# Altium project Terra.PrjPcb (part 1 of 3)
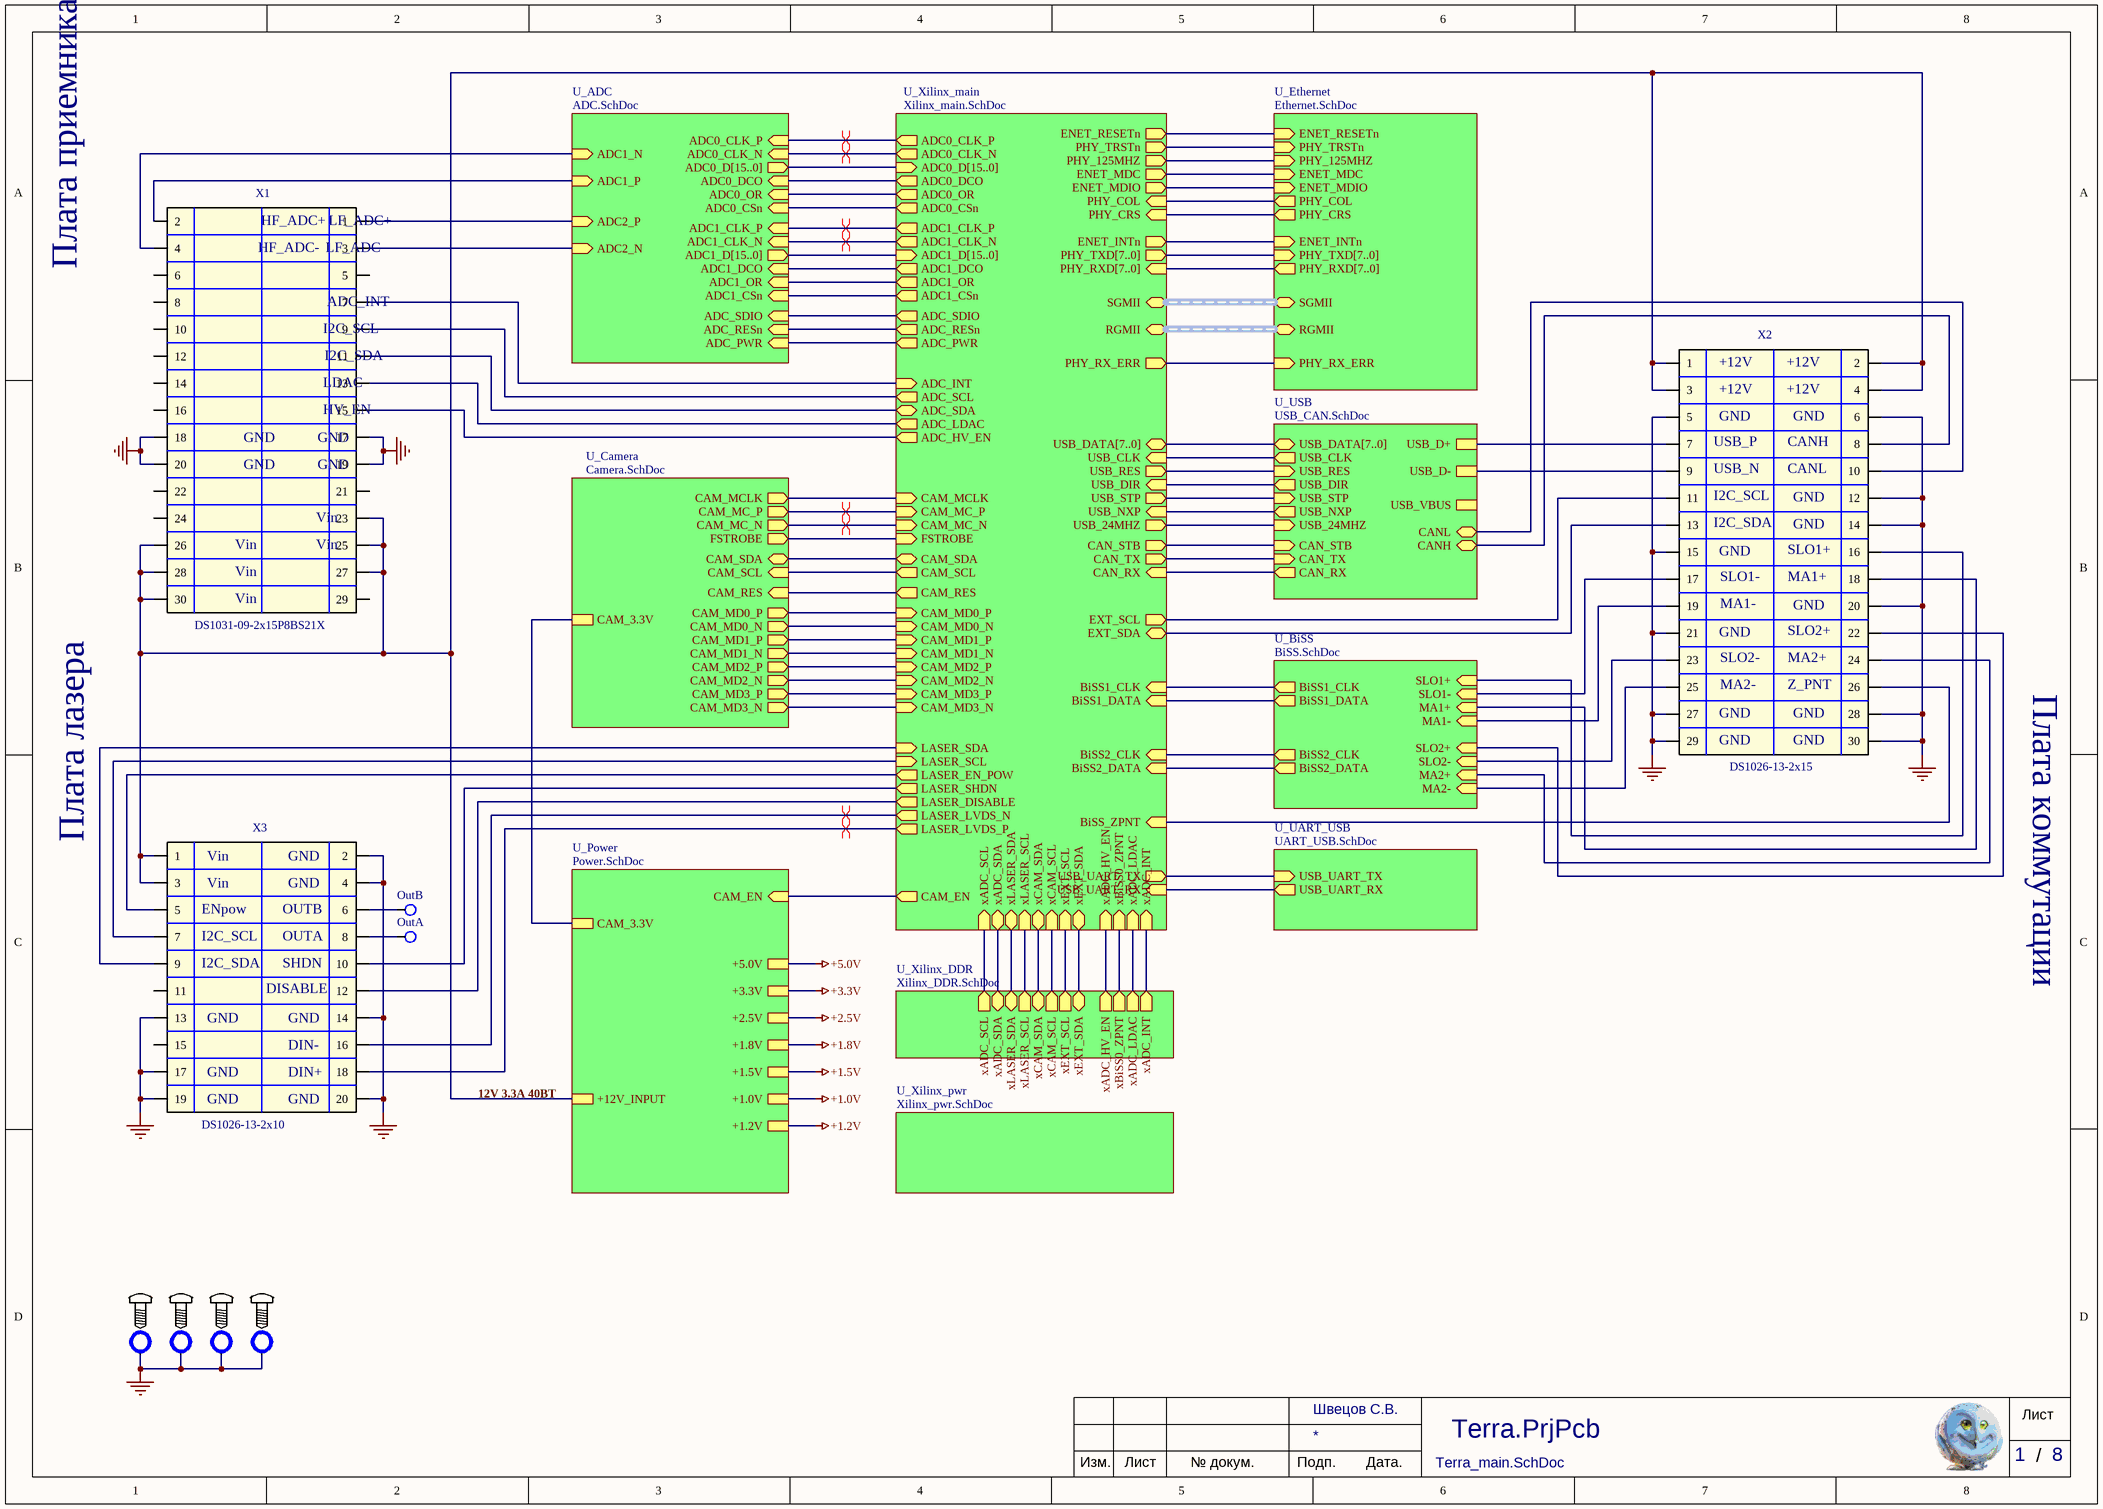
[diagram p0: Terra_main.SchDoc]
11 sheets, 559 parts. Net scope: hierarchical (ports join the sheet entries above them; power ports are global).
Board file: Terra.PcbDoc
Sheets:
  Terra_main.SchDoc
    U_Xilinx_main = Xilinx_main.SchDoc
    U_USB = USB_CAN.SchDoc
    U_BiSS = BiSS.SchDoc
    U_UART_USB = UART_USB.SchDoc
    U_Xilinx_DDR = Xilinx_DDR.SchDoc
    U_Xilinx_pwr = Xilinx_pwr.SchDoc
    U_ADC = ADC.SchDoc
    U_Power = Power.SchDoc
    U_Ethernet = Ethernet.SchDoc
    U_Camera = Camera.SchDoc

## Sheet Terra_main.SchDoc
size A3; Author: Швецов С.В.; Organization: PapuaSoft; SheetNumber: 1; SheetTotal: 8

### Parts
DRL1  Drill  [Drill 3.2]  (value not drawn)  (no BOM)
DRL2  Drill  [Drill 3.2]  (value not drawn)  (no BOM)
DRL3  Drill  [Drill 3.2]  (value not drawn)  (no BOM)
DRL4  Drill  [Drill 3.2]  (value not drawn)  (no BOM)
TP5  MarkPCB: OutB  [TP_0MM5_1MM0]  (no BOM)
TP6  MarkPCB: OutA  [TP_0MM5_1MM0]  (no BOM)
X1  DS1031-09-2x15P8BS21X  [DS1031-09-2x15]
X2  DS1026-13-2x15  [DS1026-13-2x15]
X3  value DS1026-13-2x10  [DS1026-13-2x10]  (hidden comment: DS1031-09-2x10P8BS21X)

### Sub-sheets
U_ADC = ADC.SchDoc: ADC0_CLK_N (in), ADC0_CLK_P (in), ADC1_CLK_N (in), ADC1_CLK_P (in), ADC0_D[15..0] (out), ADC1_D[15..0] (out), ADC1_P (in), ADC1_N (in), ADC2_P (in), ADC2_N (in), ADC_RESn (in), ADC0_CSn (in), ADC_SDIO (in), ADC_PWR (in), ADC1_CSn (in), ADC0_OR (in), ADC0_DCO (in), ADC1_OR (in), ADC1_DCO (in)
U_BiSS = BiSS.SchDoc: BiSS1_CLK (out), BiSS1_DATA (out), BiSS2_CLK (out), BiSS2_DATA (out), SLO1+ (in), SLO1- (in), MA1- (in), MA1+ (in), SLO2+ (in), SLO2- (in), MA2- (in), MA2+ (in)
U_Camera = Camera.SchDoc: CAM_SCL (in), CAM_SDA (bidir), CAM_MCLK (out), CAM_RES (in), CAM_3.3V, CAM_MC_P (out), CAM_MC_N (out), FSTROBE (out), CAM_MD3_N (out), CAM_MD3_P (out), CAM_MD2_N (out), CAM_MD2_P (out), CAM_MD1_N (out), CAM_MD1_P (out), CAM_MD0_N (out), CAM_MD0_P (out)
U_Ethernet = Ethernet.SchDoc: ENET_RESETn (in), PHY_TRSTn (in), PHY_125MHZ (in), ENET_MDC (in), ENET_MDIO (in), PHY_COL (out), PHY_CRS (out), SGMII (bidir), ENET_INTn (in), PHY_TXD[7..0] (in), PHY_RXD[7..0] (out), RGMII (bidir), PHY_RX_ERR (in)
U_Power = Power.SchDoc: +1.0V, +1.8V, +1.5V, +12V_INPUT, CAM_EN (in), CAM_3.3V, +3.3V, +5.0V, +2.5V, +1.2V
U_UART_USB = UART_USB.SchDoc: USB_UART_TX (in), USB_UART_RX (out)
U_USB = USB_CAN.SchDoc: USB_DATA[7..0] (bidir), USB_CLK (out), USB_NXP (out), USB_DIR (out), USB_STP (in), USB_RES (in), CAN_TX (in), CAN_RX (out), CAN_STB (in), CANH (bidir), CANL (bidir), USB_VBUS, USB_D-, USB_D+, USB_24MHZ (in)
U_Xilinx_DDR = Xilinx_DDR.SchDoc: xADC_SCL (out), xADC_SDA (bidir), xLASER_SDA (bidir), xLASER_SCL (out), xCAM_SDA (bidir), xCAM_SCL (out), xEXT_SCL (out), xEXT_SDA (bidir), xADC_HV_EN (out), xBiSS0_ZPNT (out), xADC_LDAC (out), xADC_INT (out)
U_Xilinx_main = Xilinx_main.SchDoc: ADC_SDA (bidir), ADC_SCL (out), CAM_EN (out), USB_CLK (in), USB_DIR (in), USB_RES (out), USB_DATA[7..0] (bidir), USB_STP (out), USB_NXP (in), BiSS1_CLK (in), BiSS1_DATA (in), BiSS_ZPNT (in), BiSS2_CLK (in), BiSS2_DATA (in), LASER_SHDN (out), LASER_DISABLE (out), LASER_EN_POW (out), LASER_LVDS_N (out), LASER_SDA (in), LASER_SCL (in), LASER_LVDS_P (out), USB_UART_RX (in), USB_UART_TX (out), CAN_STB (out), CAN_RX (in), CAN_TX (out), ADC_INT (in), ADC_LDAC (out), ADC_HV_EN (out), USB_24MHZ (out), ADC0_CLK_P (out), ADC0_CLK_N (out), ADC0_DCO (out), ADC0_OR (out), ADC0_CSn (out), ADC1_CLK_P (out), ADC1_CLK_N (out), ADC1_DCO (out), ADC1_OR (out), ADC1_CSn (out), ADC_SDIO (out), ADC_RESn (out), ADC_PWR (out), ADC0_D[15..0] (in), ADC1_D[15..0] (in), ENET_RESETn (out), PHY_TRSTn (out), PHY_125MHZ (out), ENET_MDC (out), ENET_MDIO (out), PHY_COL (in), PHY_CRS (in), ENET_INTn (out), PHY_RX_ERR (out), PHY_TXD[7..0] (out), PHY_RXD[7..0] (in), EXT_SDA (bidir), EXT_SCL (out), CAM_MCLK (in), CAM_MC_P (in), CAM_MC_N (in), FSTROBE (in), CAM_SDA (bidir), CAM_SCL (out), CAM_RES (out), CAM_MD3_N (in), CAM_MD3_P (in), CAM_MD2_N (in), CAM_MD2_P (in), CAM_MD1_N (in), CAM_MD1_P (in), CAM_MD0_N (in), CAM_MD0_P (in), xLASER_SDA (bidir), xLASER_SCL (in), xCAM_SDA (bidir), xCAM_SCL (in), xEXT_SDA (bidir), xEXT_SCL (in), xADC_SDA (bidir), xADC_SCL (in), xADC_HV_EN (in), xBiSS0_ZPNT (in), xADC_LDAC (in), xADC_INT (in), SGMII (bidir), RGMII (bidir)
U_Xilinx_pwr = Xilinx_pwr.SchDoc: no entries

### Nets
GND: DRL1.1 DRL2.1 DRL3.1 DRL4.1 X1.17 X1.18 X1.19 X1.20 X1.23 X1.25 X1.26 X1.27 X1.28 X1.30 X2.1 X2.2 X2.3 X2.4 X2.5 X2.6 X2.12 X2.14 X2.15 X2.20 X2.21 X2.27 X2.28 X2.29 X2.30 X3.1 X3.2 X3.3 X3.4 X3.13 X3.14 X3.17 X3.19 X3.20 ; sheet U_Power/+12V_INPUT  [project net +12V_INPUT]
ADC0_CLK_N: sheet U_Xilinx_main/ADC0_CLK_N, sheet U_ADC/ADC0_CLK_N
ADC0_CLK_P: sheet U_Xilinx_main/ADC0_CLK_P, sheet U_ADC/ADC0_CLK_P
ADC0_CSn: sheet U_Xilinx_main/ADC0_CSn, sheet U_ADC/ADC0_CSn
ADC0_DCO: sheet U_Xilinx_main/ADC0_DCO, sheet U_ADC/ADC0_DCO
ADC0_OR: sheet U_Xilinx_main/ADC0_OR, sheet U_ADC/ADC0_OR
ADC1_CLK_N: sheet U_Xilinx_main/ADC1_CLK_N, sheet U_ADC/ADC1_CLK_N
ADC1_CLK_P: sheet U_Xilinx_main/ADC1_CLK_P, sheet U_ADC/ADC1_CLK_P
ADC1_CSn: sheet U_Xilinx_main/ADC1_CSn, sheet U_ADC/ADC1_CSn
ADC1_DCO: sheet U_Xilinx_main/ADC1_DCO, sheet U_ADC/ADC1_DCO
ADC1_OR: sheet U_Xilinx_main/ADC1_OR, sheet U_ADC/ADC1_OR
ADC_HV_EN: X1.15 ; sheet U_Xilinx_main/ADC_HV_EN
ADC_INT: X1.7 ; sheet U_Xilinx_main/ADC_INT
ADC_LDAC: X1.13 ; sheet U_Xilinx_main/ADC_LDAC
ADC_PWR: sheet U_Xilinx_main/ADC_PWR, sheet U_ADC/ADC_PWR
ADC_RESn: sheet U_Xilinx_main/ADC_RESn, sheet U_ADC/ADC_RESn
ADC_SDIO: sheet U_Xilinx_main/ADC_SDIO, sheet U_ADC/ADC_SDIO
BiSS0_ZPNT: X2.26 ; sheet U_Xilinx_main/BiSS_ZPNT
CAM_EN: sheet U_Xilinx_main/CAM_EN, sheet U_Power/CAM_EN
CAM_MC_N: sheet U_Xilinx_main/CAM_MC_N, sheet U_Camera/CAM_MC_N
CAM_MC_P: sheet U_Xilinx_main/CAM_MC_P, sheet U_Camera/CAM_MC_P
CAM_MCLK: sheet U_Xilinx_main/CAM_MCLK, sheet U_Camera/CAM_MCLK
CAM_MD0_N: sheet U_Xilinx_main/CAM_MD0_N, sheet U_Camera/CAM_MD0_N
CAM_MD0_P: sheet U_Xilinx_main/CAM_MD0_P, sheet U_Camera/CAM_MD0_P
CAM_MD1_N: sheet U_Xilinx_main/CAM_MD1_N, sheet U_Camera/CAM_MD1_N
CAM_MD1_P: sheet U_Xilinx_main/CAM_MD1_P, sheet U_Camera/CAM_MD1_P
CAM_MD2_N: sheet U_Xilinx_main/CAM_MD2_N, sheet U_Camera/CAM_MD2_N
CAM_MD2_P: sheet U_Xilinx_main/CAM_MD2_P, sheet U_Camera/CAM_MD2_P
CAM_MD3_N: sheet U_Xilinx_main/CAM_MD3_N, sheet U_Camera/CAM_MD3_N
CAM_MD3_P: sheet U_Xilinx_main/CAM_MD3_P, sheet U_Camera/CAM_MD3_P
CAM_RES: sheet U_Xilinx_main/CAM_RES, sheet U_Camera/CAM_RES
ENET_INTn: sheet U_Xilinx_main/ENET_INTn, sheet U_Ethernet/ENET_INTn
ENET_MDC: sheet U_Xilinx_main/ENET_MDC, sheet U_Ethernet/ENET_MDC
ENET_MDIO: sheet U_Xilinx_main/ENET_MDIO, sheet U_Ethernet/ENET_MDIO
ENET_RESETn: sheet U_Xilinx_main/ENET_RESETn, sheet U_Ethernet/ENET_RESETn
FSTROBE: sheet U_Xilinx_main/FSTROBE, sheet U_Camera/FSTROBE
LASER_LVDS_N: X3.16 ; sheet U_Xilinx_main/LASER_LVDS_N
LASER_LVDS_P: X3.18 ; sheet U_Xilinx_main/LASER_LVDS_P
LS_DISABLE: X3.12 ; sheet U_Xilinx_main/LASER_DISABLE
LS_EN_POW: X3.5 ; sheet U_Xilinx_main/LASER_EN_POW
LS_SHDN: X3.10 ; sheet U_Xilinx_main/LASER_SHDN
MA1+: X2.18 ; sheet U_BiSS/MA1+
MA1-: X2.19 ; sheet U_BiSS/MA1-
MA2+: X2.24 ; sheet U_BiSS/MA2+
MA2-: X2.25 ; sheet U_BiSS/MA2-
PHY_125MHZ: sheet U_Xilinx_main/PHY_125MHZ, sheet U_Xilinx_main/PHY_COL, sheet U_Ethernet/PHY_125MHZ, sheet U_Ethernet/PHY_COL
PHY_CRS: sheet U_Xilinx_main/PHY_CRS, sheet U_Ethernet/PHY_CRS
PHY_RX_ERR: sheet U_Xilinx_main/PHY_RX_ERR, sheet U_Ethernet/PHY_RX_ERR
PHY_TRSTn: sheet U_Xilinx_main/PHY_TRSTn, sheet U_Ethernet/PHY_TRSTn
SCA: sheet U_Xilinx_main/CAM_SDA, sheet U_Camera/CAM_SDA
SCL: sheet U_Xilinx_main/CAM_SCL, sheet U_Camera/CAM_SCL
SLO1+: X2.16 ; sheet U_BiSS/SLO1+
SLO1-: X2.17 ; sheet U_BiSS/SLO1-
SLO2+: X2.22 ; sheet U_BiSS/SLO2+
SLO2-: X2.23 ; sheet U_BiSS/SLO2-
xADC_HV_EN: sheet U_Xilinx_main/xADC_HV_EN, sheet U_Xilinx_DDR/xADC_HV_EN
xADC_INT: sheet U_Xilinx_main/xADC_INT, sheet U_Xilinx_DDR/xADC_INT
xADC_LDAC: sheet U_Xilinx_main/xADC_LDAC, sheet U_Xilinx_DDR/xADC_LDAC
xADC_SCL: sheet U_Xilinx_main/xADC_SCL, sheet U_Xilinx_DDR/xADC_SCL
xADC_SDA: sheet U_Xilinx_main/xADC_SDA, sheet U_Xilinx_DDR/xADC_SDA
xBiSS0_ZPNT: sheet U_Xilinx_main/xBiSS0_ZPNT, sheet U_Xilinx_DDR/xBiSS0_ZPNT
xBiSS1_CLK: sheet U_Xilinx_main/BiSS1_CLK, sheet U_Xilinx_main/xEXT_SCL, sheet U_BiSS/BiSS1_CLK, sheet U_Xilinx_DDR/xEXT_SCL
xBiSS1_DATA: sheet U_Xilinx_main/BiSS1_DATA, sheet U_BiSS/BiSS1_DATA
xBiSS2_CLK: sheet U_Xilinx_main/BiSS2_CLK, sheet U_BiSS/BiSS2_CLK
xBiSS2_DATA: sheet U_Xilinx_main/BiSS2_DATA, sheet U_BiSS/BiSS2_DATA
xCAM_SCL: sheet U_Xilinx_main/xCAM_SCL, sheet U_Xilinx_DDR/xCAM_SCL
xCAM_SDA: sheet U_Xilinx_main/xCAM_SDA, sheet U_Xilinx_DDR/xCAM_SDA
xCAN_RX: sheet U_Xilinx_main/CAN_RX, sheet U_USB/CAN_RX
xCAN_STB: sheet U_Xilinx_main/CAN_STB, sheet U_USB/CAN_STB
xCAN_TX: sheet U_Xilinx_main/CAN_TX, sheet U_USB/CAN_TX
xEXT_SDA: sheet U_Xilinx_main/xEXT_SDA, sheet U_Xilinx_DDR/xEXT_SDA
xLS_SCL: sheet U_Xilinx_main/xLASER_SCL, sheet U_Xilinx_DDR/xLASER_SCL
xLS_SDA: sheet U_Xilinx_main/xLASER_SDA, sheet U_Xilinx_DDR/xLASER_SDA
xUSB_24MHZ: sheet U_Xilinx_main/USB_24MHZ, sheet U_USB/USB_24MHZ
xUSB_DIR: sheet U_Xilinx_main/USB_DIR, sheet U_USB/USB_DIR
xUSB_NXP: sheet U_Xilinx_main/USB_NXP, sheet U_USB/USB_NXP
xUSB_RES: sheet U_Xilinx_main/USB_RES, sheet U_USB/USB_RES
xUSB_SCK: sheet U_Xilinx_main/USB_CLK, sheet U_USB/USB_CLK
xUSB_STP: sheet U_Xilinx_main/USB_STP, sheet U_USB/USB_STP
xUSB_UART_RX: sheet U_Xilinx_main/USB_UART_RX, sheet U_UART_USB/USB_UART_RX
xUSB_UART_TX: sheet U_Xilinx_main/USB_UART_TX, sheet U_UART_USB/USB_UART_TX
NetC6_2: X1.2 ; sheet U_ADC/ADC1_P
NetC9_2: X1.4 ; sheet U_ADC/ADC1_N
NetC21_2: X1.1 ; sheet U_ADC/ADC2_P
NetC24_2: X1.3 ; sheet U_ADC/ADC2_N
NetC61_1: sheet U_Power/CAM_3.3V, sheet U_Camera/CAM_3.3V
NetR62_1: X2.9 ; sheet U_USB/USB_D-
NetR63_1: X2.7 ; sheet U_USB/USB_D+
NetR66_2: X2.8 ; sheet U_USB/CANH
NetR67_1: X2.10 ; sheet U_USB/CANL
NetR102_1: X1.9 ; sheet U_Xilinx_main/ADC_SCL
NetR103_1: X1.11 ; sheet U_Xilinx_main/ADC_SDA
NetR112_1: X3.7 ; sheet U_Xilinx_main/LASER_SCL
NetR113_1: X3.9 ; sheet U_Xilinx_main/LASER_SDA
NetR117_1: X2.11 ; sheet U_Xilinx_main/EXT_SCL
NetR118_1: X2.13 ; sheet U_Xilinx_main/EXT_SDA
NetTP5_1: TP5.1(e1) X3.6
NetTP6_1: TP6.1(e1) X3.8

Not connected (* = marked no-connect by the designer): X1 5 6 8 10 12 14 16 21 22 24 29; X3 11 15

### Buses and harness runs
bus sheet U_ADC/ADC0_D[15..0] = sheet U_Xilinx_main/ADC0_D[15..0]
bus sheet U_ADC/ADC1_D[15..0] = sheet U_Xilinx_main/ADC1_D[15..0]
bus sheet U_Ethernet/PHY_RXD[7..0] = sheet U_Xilinx_main/PHY_RXD[7..0]
bus sheet U_Ethernet/PHY_TXD[7..0] = sheet U_Xilinx_main/PHY_TXD[7..0]
bus sheet U_USB/USB_DATA[7..0] = sheet U_Xilinx_main/USB_DATA[7..0]
harness sheet U_Ethernet/RGMII = sheet U_Xilinx_main/RGMII
harness sheet U_Ethernet/SGMII = sheet U_Xilinx_main/SGMII

### Layout directives
differential pair: ADC0_CLK_N, ADC0_CLK_P, ADC1_CLK_N, ADC1_CLK_P, CAM_MC_N, CAM_MC_P, LASER_LVDS_N, LASER_LVDS_P

### Notes on the sheet
- (near X1) HF_ADC+
- (near X1) LF_ADC+
- Плата приемника
- (near X1) HF_ADC-
- (near X1) LF_ADC-
- (near X1) ADC_INT
- (near X1) I2C_SCL
- (near X1) I2C_SDA
- (near X2) +12V
- (near X1) GND
- (near X1) LDAC
- (near X1) HV_EN
- (near X2) USB_P
- (near X2) GND
- (near X2) CANH
- (near X2) I2C_SCL
- (near X2) USB_N
- (near X2) CANL
- (near X1) Vin
- (near X2) I2C_SDA
- (near X2) SLO1-
- (near X2) SLO1+
- (near X2) MA1+
- (near X2) MA1-
- (near X2) SLO2+
- (near X2) SLO2-
- (near X2) MA2-
- (near X2) Z_PNT
- (near X2) MA2+
- Плата коммутации
- Плата лазера
- (near X3) ENpow
- (near X3) Vin
- (near X3) OUTB
- (near X3) GND
- (near X3) I2C_SCL
- (near X3) I2C_SDA
- (near X3) DISABLE
- (near X3) OUTA
- (near X3) SHDN
- (near X3) DIN-
- (near X3) DIN+
- 12V 3.3A 40ВТ
- Лист
- /
- Изм.
- № докум.
- Подп.
- Дата.

### Library data of the parts
DRL1-DRL4 = Drill: Крепёжное отверстие
TP5 TP6 = Test_Point: Тестовая точка на плате
X1 = CON2x15: Штыри 2x15 1.27 мм на плату; Value: DS1031-09-2x15P8BS21X; Parameter 1: *
X2 = CON2x15: Гнезда 2x15 2.0мм угловые на плату; Value: DS1056-10-2x15
X3 = CON2x10: Штыри 2x10  2.0 мм на плату

## Sheet Xilinx_main.SchDoc
size A3; Author: Швецов С.В.; Organization: PapuaSoft; SheetNumber: 3; SheetTotal: 8; PageSetup: Record=PageOptions|CenterHorizontal=True|CenterVertical=True|PrintScale=0.71|XCorrection=1.00|YCorrection=1.00|PrintKind=1|BorderSize=5000000|LeftOffset=0|BottomOffset=0|Orientation=2|PaperLength=1000|PaperWidth=1000|Scale=100|PaperSource=15|PrintQuality=600|MediaType=1|DitherType=10|PaperKind=A4|PrintScaleMode=1
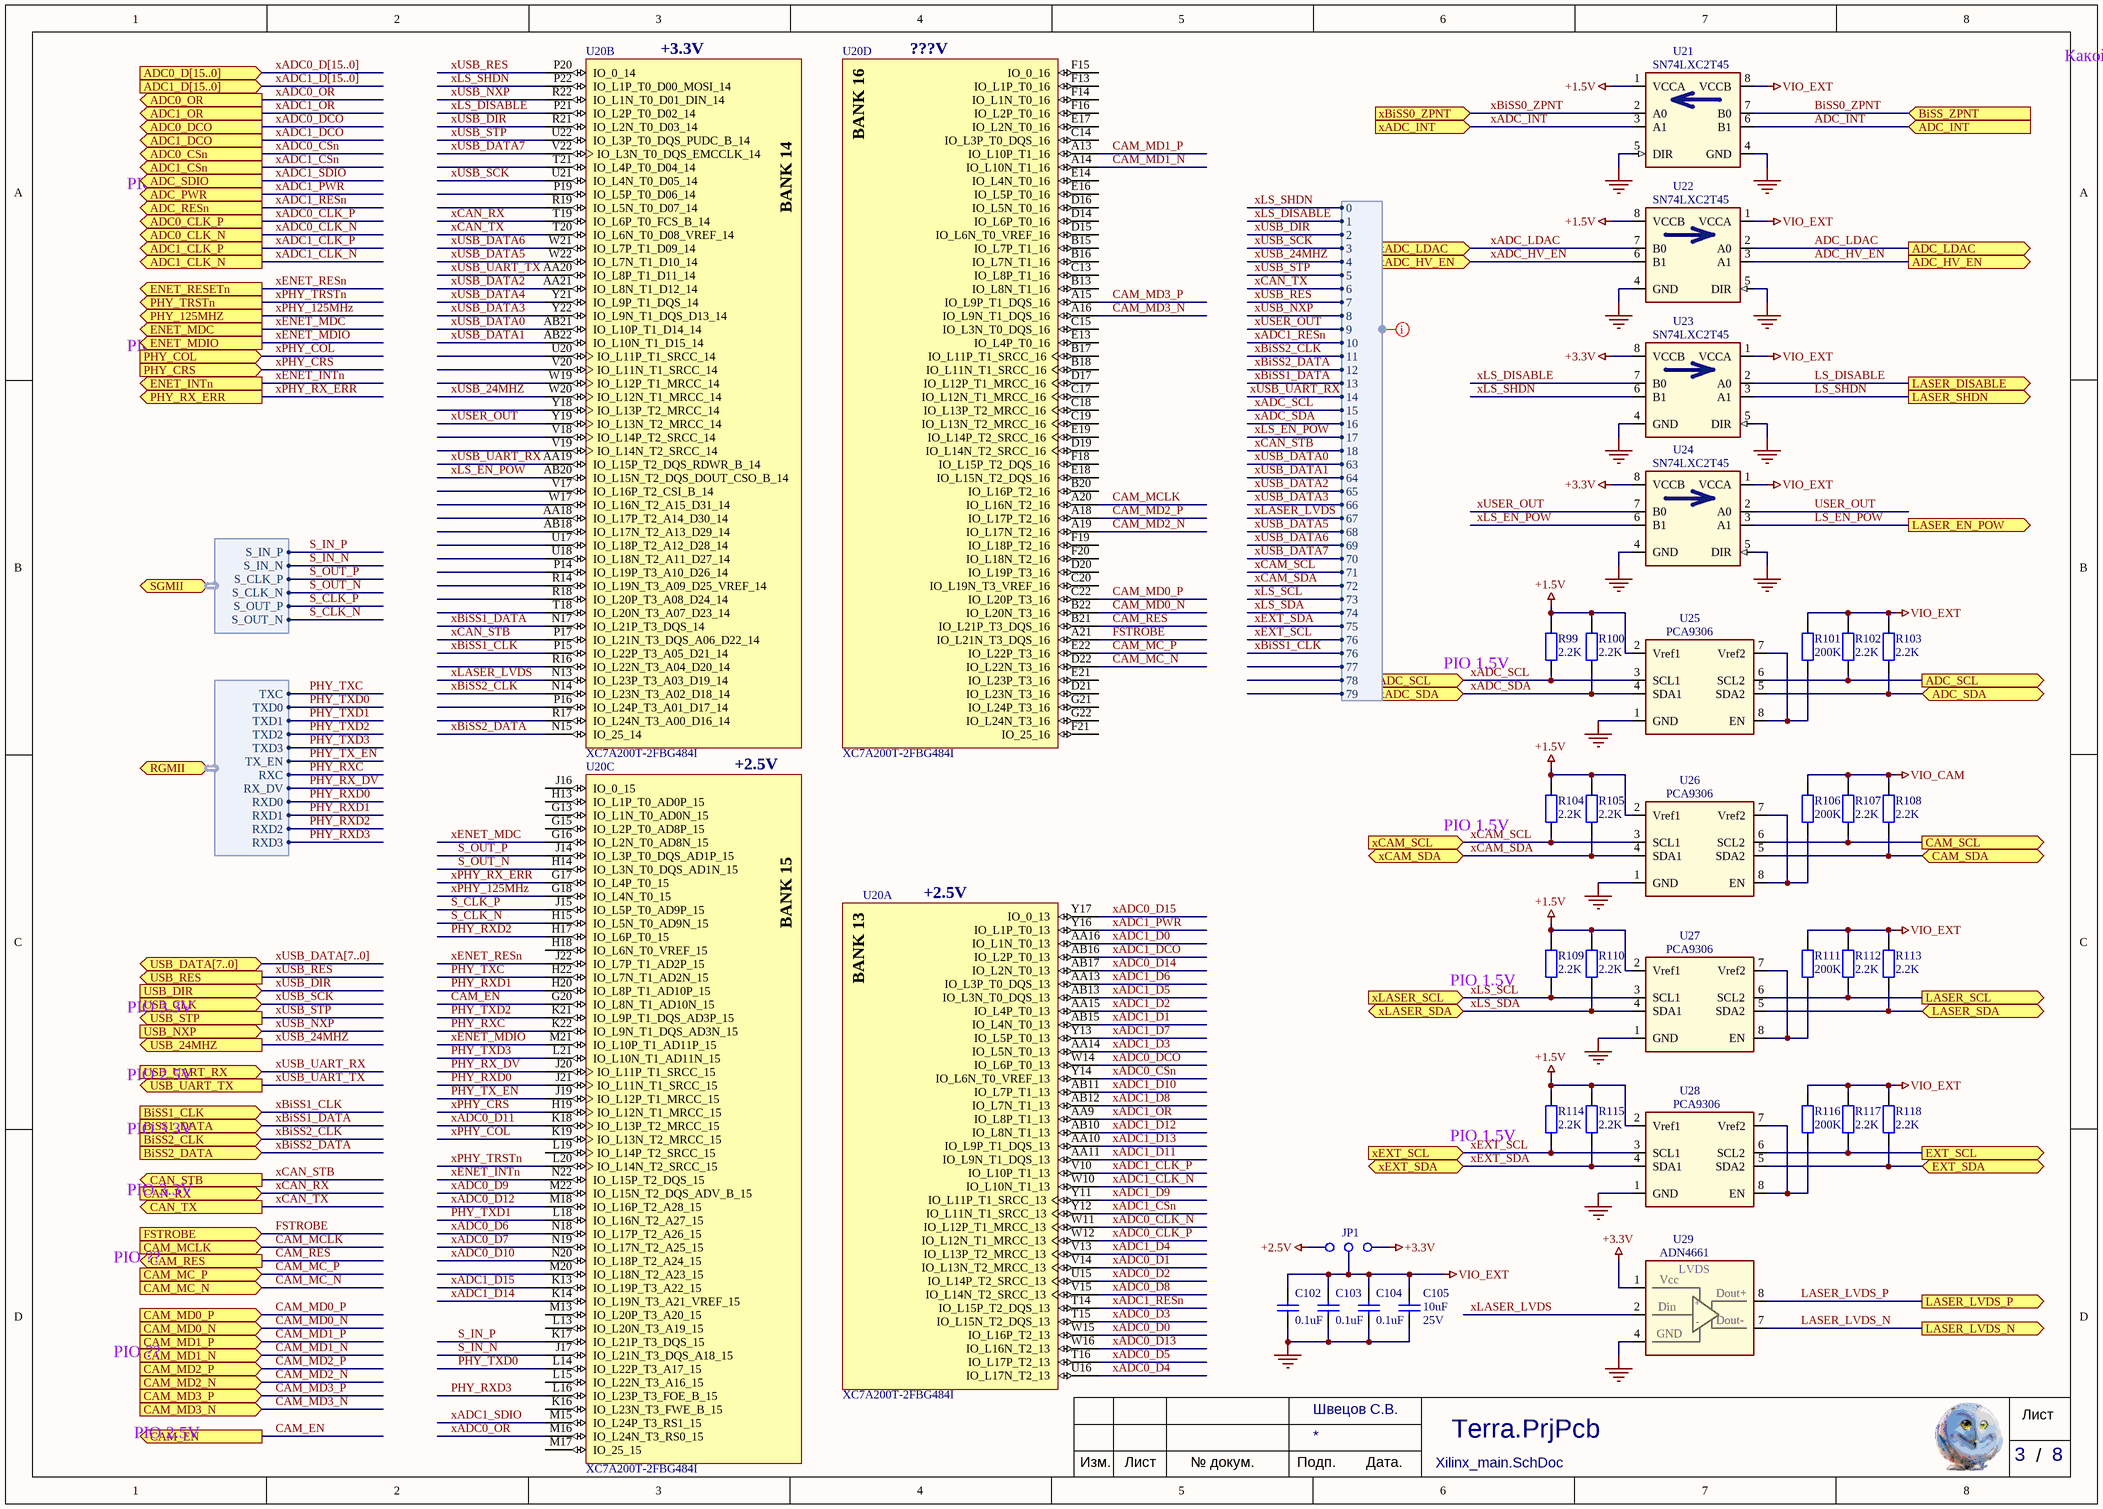
[diagram p1: Xilinx_main.SchDoc]

### Parts
C102  value 0.1uF  [C0402]  (hidden comment: Cap)
C103  value 0.1uF  [C0402]  (hidden comment: Cap)
C104  value 0.1uF  [C0402]  (hidden comment: Cap)
C105  value 10uF  Voltage: 25V  [C0805]  (hidden comment: Cap)
JP1  (no value)  [JUMP-3]  (no BOM)
R99  value 2.2K  [R0402]  (hidden comment: Res2)
R100  value 2.2K  [R0402]  (hidden comment: Res2)
R101  value 200K  [R0402]  (hidden comment: Res2)
R102  value 2.2K  [R0402]  (hidden comment: Res2)
R103  value 2.2K  [R0402]  (hidden comment: Res2)
R104  value 2.2K  [R0402]  (hidden comment: Res2)
R105  value 2.2K  [R0402]  (hidden comment: Res2)
R106  value 200K  [R0402]  (hidden comment: Res2)
R107  value 2.2K  [R0402]  (hidden comment: Res2)
R108  value 2.2K  [R0402]  (hidden comment: Res2)
R109  value 2.2K  [R0402]  (hidden comment: Res2)
R110  value 2.2K  [R0402]  (hidden comment: Res2)
R111  value 200K  [R0402]  (hidden comment: Res2)
R112  value 2.2K  [R0402]  (hidden comment: Res2)
R113  value 2.2K  [R0402]  (hidden comment: Res2)
R114  value 2.2K  [R0402]  (hidden comment: Res2)
R115  value 2.2K  [R0402]  (hidden comment: Res2)
R116  value 200K  [R0402]  (hidden comment: Res2)
R117  value 2.2K  [R0402]  (hidden comment: Res2)
R118  value 2.2K  [R0402]  (hidden comment: Res2)
U20  XC7A200T-2FBG484I  BANK_PWR: +2.5V  [FBG484]  (parts A,B,C,D of 11)
U21  SN74LXC2T45  [SOP50P310X90-8N]
U22  SN74LXC2T45  [SOP50P310X90-8N]
U23  SN74LXC2T45  [SOP50P310X90-8N]
U24  SN74LXC2T45  [SOP50P310X90-8N]
U25  PCA9306  [7WBD3306AMUTCG]
U26  PCA9306  [7WBD3306AMUTCG]
U27  PCA9306  [7WBD3306AMUTCG]
U28  PCA9306  [7WBD3306AMUTCG]
U29  ADN4661  [SO8]

### Ports
ADC0_CLK_N (out), ADC0_CLK_P (out), ADC0_CSn (out), ADC0_D[15..0] (in), ADC0_DCO (out), ADC0_OR (out), ADC1_CLK_N (out), ADC1_CLK_P (out), ADC1_CSn (out), ADC1_D[15..0] (in), ADC1_DCO (out), ADC1_OR (out), ADC_HV_EN (out), ADC_INT (in), ADC_LDAC (out), ADC_PWR (out), ADC_RESn (out), ADC_SCL (out), ADC_SDA (bidir), ADC_SDIO (out), BiSS1_CLK (in), BiSS1_DATA (in), BiSS2_CLK (in), BiSS2_DATA (in), BiSS_ZPNT (in), CAM_EN (out), CAM_MC_N (in), CAM_MC_P (in), CAM_MCLK (in), CAM_MD0_N (in), CAM_MD0_P (in), CAM_MD1_N (in), CAM_MD1_P (in), CAM_MD2_N (in), CAM_MD2_P (in), CAM_MD3_N (in), CAM_MD3_P (in), CAM_RES (out), CAM_SCL (out), CAM_SDA (bidir), CAN_RX (in), CAN_STB (out), CAN_TX (out), ENET_INTn (out), ENET_MDC (out), ENET_MDIO (out), ENET_RESETn (out), EXT_SCL (out), EXT_SDA (bidir), FSTROBE (in), LASER_DISABLE (out), LASER_EN_POW (out), LASER_LVDS_N (out), LASER_LVDS_P (out), LASER_SCL (out), LASER_SDA (bidir), LASER_SHDN (out), PHY_125MHZ (out), PHY_COL (in), PHY_CRS (in), PHY_RX_ERR (out), PHY_TRSTn (out), RGMII (bidir, harness RGMII), SGMII (bidir, harness SGMII), USB_24MHZ (out), USB_CLK (in), USB_DATA[7..0] (bidir), USB_DIR (in), USB_NXP (in), USB_RES (out), USB_STP (out), USB_UART_RX (in), USB_UART_TX (out), xADC_HV_EN (in), xADC_INT (in), xADC_LDAC (in), xADC_SCL (in), xADC_SDA (bidir), xBiSS0_ZPNT (in), xCAM_SCL (in), xCAM_SDA (bidir), xEXT_SCL (in), xEXT_SDA (bidir), xLASER_SCL (in), xLASER_SDA (bidir)

### Harnesses
PLIS_OTHER: 0, 1, 2, 3, 4, 5, 6, 7, 8, 9, 10, 12, 13, 14, 11, 15, 16, 17, 18, 63, 64, 65, 66, 67, 68, 69, 70, 71, 72, 73, 74, 75, 76, 76, 77, 78, 79
SGMII: S_IN_P, S_IN_N, S_CLK_P, S_CLK_N, S_OUT_P, S_OUT_N
RGMII: TXC, TXD0, TXD1, TXD2, TXD3, TX_EN, RXC, RX_DV, RXD0, RXD1, RXD2, RXD3

### Nets
+1.5V: R99.2 R100.2 R104.2 R105.2 R109.2 R110.2 R114.2 R115.2 U21.1(VCCA) U22.8(VCCB) U25.2(Vref1) U26.2(Vref1) U27.2(Vref1) U28.2(Vref1)
+2.5V: JP1.1
+3.3V: JP1.3 U23.8(VCCB) U24.8(VCCB) U29.1(Vss)
GND: C102.2 C103.2 C104.2 C105.2 U21.4(GND) U21.5(DIR) U22.4(GND) U22.5(DIR) U23.4(GND) U23.5(DIR) U24.4(GND) U24.5(DIR) U25.1(GND) U26.1(GND) U27.1(GND) U28.1(GND) U29.4(GND)  [project net +12V_INPUT]
VIO_CAM: R106.2 R107.2 R108.2
VIO_EXT: C102.1 C103.1 C104.1 C105.1 JP1.2 R101.2 R102.2 R103.2 R111.2 R112.2 R113.2 R116.2 R117.2 R118.2 U21.8(VCCB) U22.1(VCCA) U23.1(VCCA) U24.1(VCCA)
ADC_HV_EN: U22.3(A1) ; port ADC_HV_EN
ADC_INT: U21.6(B1) ; port ADC_INT
ADC_LDAC: U22.2(A0) ; port ADC_LDAC
BiSS0_ZPNT: U21.7(B0) ; port BiSS_ZPNT
CAM_EN: U20.G20(IO_L8N_T1_AD10N_15) ; port CAM_EN
CAM_MC_N: U20.D22(IO_L22N_T3_16) ; port CAM_MC_N
CAM_MC_P: U20.E22(IO_L22P_T3_16) ; port CAM_MC_P
CAM_MCLK: U20.A20(IO_L16N_T2_16) ; port CAM_MCLK
CAM_MD0_N: U20.B22(IO_L20N_T3_16) ; port CAM_MD0_N
CAM_MD0_P: U20.C22(IO_L20P_T3_16) ; port CAM_MD0_P
CAM_MD1_N: U20.A14(IO_L10N_T1_16) ; port CAM_MD1_N
CAM_MD1_P: U20.A13(IO_L10P_T1_16) ; port CAM_MD1_P
CAM_MD2_N: U20.A19(IO_L17N_T2_16) ; port CAM_MD2_N
CAM_MD2_P: U20.A18(IO_L17P_T2_16) ; port CAM_MD2_P
CAM_MD3_N: U20.A16(IO_L9N_T1_DQS_16) ; port CAM_MD3_N
CAM_MD3_P: U20.A15(IO_L9P_T1_DQS_16) ; port CAM_MD3_P
CAM_RES: U20.B21(IO_L21P_T3_DQS_16) ; port CAM_RES
FSTROBE: U20.A21(IO_L21N_T3_DQS_16) ; port FSTROBE
LASER_LVDS_N: U29.7(OUT0-) ; port LASER_LVDS_N
LASER_LVDS_P: U29.8(OUT0+) ; port LASER_LVDS_P
LS_DISABLE: U23.2(A0) ; port LASER_DISABLE
LS_EN_POW: U24.3(A1) ; port LASER_EN_POW
LS_SHDN: U23.3(A1) ; port LASER_SHDN
PHY_RX_DV: U20.J20(IO_L11P_T1_SRCC_15) ; port RGMII.RX_DV
PHY_RXC: U20.K22(IO_L9N_T1_DQS_AD3N_15) ; port RGMII.RXC
PHY_RXD0: U20.J21(IO_L11N_T1_SRCC_15) ; port RGMII.RXD0
PHY_RXD1: U20.H20(IO_L8P_T1_AD10P_15) ; port RGMII.RXD1
PHY_RXD2: U20.H17(IO_L6P_T0_15) ; port RGMII.RXD2
PHY_RXD3: U20.L16(IO_L23P_T3_FOE_B_15) ; port RGMII.RXD3
PHY_TX_EN: U20.J19(IO_L12P_T1_MRCC_15) ; port RGMII.TX_EN
PHY_TXC: U20.H22(IO_L7N_T1_AD2N_15) ; port RGMII.TXC
PHY_TXD0: U20.L14(IO_L22P_T3_A17_15) ; port RGMII.TXD0
PHY_TXD1: U20.L18(IO_L16N_T2_A27_15) ; port RGMII.TXD1
PHY_TXD2: U20.K21(IO_L9P_T1_DQS_AD3P_15) ; port RGMII.TXD2
PHY_TXD3: U20.L21(IO_L10N_T1_AD11N_15) ; port RGMII.TXD3
S_CLK_N: U20.H15(IO_L5N_T0_AD9N_15) ; port SGMII.S_OUT_N
S_CLK_P: U20.J15(IO_L5P_T0_AD9P_15) ; port SGMII.S_OUT_P
S_IN_N: U20.J17(IO_L21N_T3_DQS_A18_15) ; port SGMII.S_IN_N
S_IN_P: U20.K17(IO_L21P_T3_DQS_15) ; port SGMII.S_IN_P
S_OUT_N: U20.H14(IO_L3N_T0_DQS_AD1N_15) ; port SGMII.S_CLK_N
S_OUT_P: U20.J14(IO_L3P_T0_DQS_AD1P_15) ; port SGMII.S_CLK_P
SCA: R108.1 U26.5(SDA2) ; port CAM_SDA
SCL: R107.1 U26.6(SCL2) ; port CAM_SCL
USER_OUT: U24.2(A0)
xADC0_CLK_N: U20.W11(IO_L12P_T1_MRCC_13) ; port ADC0_CLK_N  [project net ADC0_CLK_N]
xADC0_CLK_P: U20.W12(IO_L12N_T1_MRCC_13) ; port ADC0_CLK_P  [project net ADC0_CLK_P]
xADC0_CSn: U20.Y14(IO_L6N_T0_VREF_13) ; port ADC0_CSn  [project net ADC0_CSn]
xADC0_D0: U20.W15(IO_L16P_T2_13)  [project net ADC0_D0]
xADC0_D1: U20.V14(IO_L13N_T2_MRCC_13)  [project net ADC0_D1]
xADC0_D2: U20.U15(IO_L14P_T2_SRCC_13)  [project net ADC0_D2]
xADC0_D3: U20.T15(IO_L15N_T2_DQS_13)  [project net ADC0_D3]
xADC0_D4: U20.U16(IO_L17N_T2_13)  [project net ADC0_D4]
xADC0_D5: U20.T16(IO_L17P_T2_13)  [project net ADC0_D5]
xADC0_D6: U20.N18(IO_L17P_T2_A26_15)  [project net ADC0_D6]
xADC0_D7: U20.N19(IO_L17N_T2_A25_15)  [project net ADC0_D7]
xADC0_D8: U20.V15(IO_L14N_T2_SRCC_13)  [project net ADC0_D8]
xADC0_D9: U20.M22(IO_L15N_T2_DQS_ADV_B_15)  [project net ADC0_D9]
xADC0_D10: U20.N20(IO_L18P_T2_A24_15)  [project net ADC0_D10]
xADC0_D11: U20.K18(IO_L13P_T2_MRCC_15)  [project net ADC0_D11]
xADC0_D12: U20.M18(IO_L16P_T2_A28_15)  [project net ADC0_D12]
xADC0_D13: U20.W16(IO_L16N_T2_13)  [project net ADC0_D13]
xADC0_D14: U20.AB17(IO_L2N_T0_13)  [project net ADC0_D14]
xADC0_D15: U20.Y17(IO_0_13)  [project net ADC0_D15]
xADC0_DCO: U20.W14(IO_L6P_T0_13) ; port ADC0_DCO  [project net ADC0_DCO]
xADC0_OR: U20.M16(IO_L24N_T3_RS0_15) ; port ADC0_OR  [project net ADC0_OR]
xADC1_CLK_N: U20.W10(IO_L10N_T1_13) ; port ADC1_CLK_N  [project net ADC1_CLK_N]
xADC1_CLK_P: U20.V10(IO_L10P_T1_13) ; port ADC1_CLK_P  [project net ADC1_CLK_P]
xADC1_CSn: U20.Y12(IO_L11N_T1_SRCC_13) ; port ADC1_CSn  [project net ADC1_CSn]
xADC1_D0: U20.AA16(IO_L1N_T0_13)  [project net ADC1_D0]
xADC1_D1: U20.AB15(IO_L4N_T0_13)  [project net ADC1_D1]
xADC1_D2: U20.AA15(IO_L4P_T0_13)  [project net ADC1_D2]
xADC1_D3: U20.AA14(IO_L5N_T0_13)  [project net ADC1_D3]
xADC1_D4: U20.V13(IO_L13P_T2_MRCC_13)  [project net ADC1_D4]
xADC1_D5: U20.AB13(IO_L3N_T0_DQS_13)  [project net ADC1_D5]
xADC1_D6: U20.AA13(IO_L3P_T0_DQS_13)  [project net ADC1_D6]
xADC1_D7: U20.Y13(IO_L5P_T0_13)  [project net ADC1_D7]
xADC1_D8: U20.AB12(IO_L7N_T1_13)  [project net ADC1_D8]
xADC1_D9: U20.Y11(IO_L11P_T1_SRCC_13)  [project net ADC1_D9]
xADC1_D10: U20.AB11(IO_L7P_T1_13)  [project net ADC1_D10]
xADC1_D11: U20.AA11(IO_L9N_T1_DQS_13)  [project net ADC1_D11]
xADC1_D12: U20.AB10(IO_L8N_T1_13)  [project net ADC1_D12]
xADC1_D13: U20.AA10(IO_L9P_T1_DQS_13)  [project net ADC1_D13]
xADC1_D14: U20.K14(IO_L19N_T3_A21_VREF_15)  [project net ADC1_D14]
xADC1_D15: U20.K13(IO_L19P_T3_A22_15)  [project net ADC1_D15]
xADC1_DCO: U20.AB16(IO_L2P_T0_13) ; port ADC1_DCO  [project net ADC1_DCO]
xADC1_OR: U20.AA9(IO_L8P_T1_13) ; port ADC1_OR  [project net ADC1_OR]
xADC1_PWR: U20.Y16(IO_L1P_T0_13) ; port ADC_PWR  [project net ADC_PWR]
xADC1_RESn: U20.T14(IO_L15P_T2_DQS_13) ; port ADC_RESn, harness PLIS_OTHER.10  [project net ADC_RESn]
xADC1_SDIO: U20.M15(IO_L24P_T3_RS1_15) ; port ADC_SDIO  [project net ADC_SDIO]
xADC_HV_EN: U22.6(B1) ; port xADC_HV_EN
xADC_INT: U21.3(A1) ; port xADC_INT
xADC_LDAC: U22.7(B0) ; port xADC_LDAC
xADC_SCL: R99.1 U25.3(SCL1) ; port xADC_SCL, harness PLIS_OTHER.15
xADC_SDA: R100.1 U25.4(SDA1) ; port xADC_SDA, harness PLIS_OTHER.16
xBiSS0_ZPNT: U21.2(A0) ; port xBiSS0_ZPNT
xBiSS1_CLK: R114.1 U20.P15(IO_L22P_T3_A05_D21_14) U28.3(SCL1) ; port BiSS1_CLK, port xEXT_SCL, harness PLIS_OTHER.76  [also labelled xEXT_SCL]
xBiSS1_DATA: U20.N17(IO_L21P_T3_DQS_14) ; port BiSS1_DATA, harness PLIS_OTHER.13
xBiSS2_CLK: U20.N14(IO_L23N_T3_A02_D18_14) ; port BiSS2_CLK, harness PLIS_OTHER.11
xBiSS2_DATA: U20.N15(IO_25_14) ; port BiSS2_DATA, harness PLIS_OTHER.12
xCAM_SCL: R104.1 U26.3(SCL1) ; port xCAM_SCL, harness PLIS_OTHER.71
xCAM_SDA: R105.1 U26.4(SDA1) ; port xCAM_SDA, harness PLIS_OTHER.72
xCAN_RX: U20.T19(IO_L6P_T0_FCS_B_14) ; port CAN_RX
xCAN_STB: U20.P17(IO_L21N_T3_DQS_A06_D22_14) ; port CAN_STB, harness PLIS_OTHER.18
xCAN_TX: U20.T20(IO_L6N_T0_D08_VREF_14) ; port CAN_TX, harness PLIS_OTHER.6
xENET_INTn: U20.N22(IO_L15P_T2_DQS_15) ; port ENET_INTn  [project net ENET_INTn]
xENET_MDC: U20.G16(IO_L2N_T0_AD8N_15) ; port ENET_MDC  [project net ENET_MDC]
xENET_MDIO: U20.M21(IO_L10P_T1_AD11P_15) ; port ENET_MDIO  [project net ENET_MDIO]
xENET_RESn: U20.J22(IO_L7P_T1_AD2P_15) ; port ENET_RESETn  [project net ENET_RESETn]
xEXT_SDA: R115.1 U28.4(SDA1) ; port xEXT_SDA, harness PLIS_OTHER.75
xLASER_LVDS: U20.N13(IO_L23P_T3_A03_D19_14) U29.2(Din+) ; harness PLIS_OTHER.67
xLS_DISABLE: U20.P21(IO_L2P_T0_D02_14) U23.7(B0) ; harness PLIS_OTHER.1
xLS_EN_POW: U20.AB20(IO_L15N_T2_DQS_DOUT_CSO_B_14) U24.6(B1) ; harness PLIS_OTHER.17
xLS_SCL: R109.1 U27.3(SCL1) ; port xLASER_SCL, harness PLIS_OTHER.73
xLS_SDA: R110.1 U27.4(SDA1) ; port xLASER_SDA, harness PLIS_OTHER.74
xLS_SHDN: U20.P22(IO_L1P_T0_D00_MOSI_14) U23.6(B1) ; harness PLIS_OTHER.0
xPHY_125MHz: U20.G18(IO_L4N_T0_15) U20.K19(IO_L13N_T2_MRCC_15) ; port PHY_125MHZ, port PHY_COL  [also labelled xPHY_COL]  [project net PHY_125MHZ]
xPHY_CRS: U20.H19(IO_L12N_T1_MRCC_15) ; port PHY_CRS  [project net PHY_CRS]
xPHY_RX_ERR: U20.G17(IO_L4P_T0_15) ; port PHY_RX_ERR  [project net PHY_RX_ERR]
xPHY_TRSTn: U20.L20(IO_L14N_T2_SRCC_15) ; port PHY_TRSTn  [project net PHY_TRSTn]
xUSB_24MHZ: U20.W20(IO_L12N_T1_MRCC_14) ; port USB_24MHZ, harness PLIS_OTHER.4
xUSB_DATA0: U20.AB21(IO_L10P_T1_D14_14) ; harness PLIS_OTHER.63  [project net USB_DATA0]
xUSB_DATA1: U20.AB22(IO_L10N_T1_D15_14) ; harness PLIS_OTHER.64  [project net USB_DATA1]
xUSB_DATA2: U20.AA21(IO_L8N_T1_D12_14) ; harness PLIS_OTHER.65  [project net USB_DATA2]
xUSB_DATA3: U20.Y22(IO_L9N_T1_DQS_D13_14) ; harness PLIS_OTHER.66  [project net USB_DATA3]
xUSB_DATA4: U20.Y21(IO_L9P_T1_DQS_14)  [project net USB_DATA4]
xUSB_DATA5: U20.W22(IO_L7N_T1_D10_14) ; harness PLIS_OTHER.68  [project net USB_DATA5]
xUSB_DATA6: U20.W21(IO_L7P_T1_D09_14) ; harness PLIS_OTHER.69  [project net USB_DATA6]
xUSB_DATA7: U20.V22(IO_L3N_T0_DQS_EMCCLK_14) ; harness PLIS_OTHER.70  [project net USB_DATA7]
xUSB_DIR: U20.R21(IO_L2N_T0_D03_14) ; port USB_DIR, harness PLIS_OTHER.2
xUSB_NXP: U20.R22(IO_L1N_T0_D01_DIN_14) ; port USB_NXP, harness PLIS_OTHER.8
xUSB_RES: U20.P20(IO_0_14) ; port USB_RES, harness PLIS_OTHER.7
xUSB_SCK: U20.U21(IO_L4N_T0_D05_14) ; port USB_CLK, harness PLIS_OTHER.3
xUSB_STP: U20.U22(IO_L3P_T0_DQS_PUDC_B_14) ; port USB_STP, harness PLIS_OTHER.5
xUSB_UART_RX: U20.AA19(IO_L15P_T2_DQS_RDWR_B_14) ; port USB_UART_RX, harness PLIS_OTHER.14
xUSB_UART_TX: U20.AA20(IO_L8P_T1_D11_14) ; port USB_UART_TX
xUSER_OUT: U20.Y19(IO_L13N_T2_MRCC_14) U24.7(B0) ; harness PLIS_OTHER.9
NetR101_1: R101.1 U25.7(Vref2) U25.8(EN)
NetR102_1: R102.1 U25.6(SCL2) ; port ADC_SCL
NetR103_1: R103.1 U25.5(SDA2) ; port ADC_SDA
NetR106_1: R106.1 U26.7(Vref2) U26.8(EN)
NetR111_1: R111.1 U27.7(Vref2) U27.8(EN)
NetR112_1: R112.1 U27.6(SCL2) ; port LASER_SCL
NetR113_1: R113.1 U27.5(SDA2) ; port LASER_SDA
NetR116_1: R116.1 U28.7(Vref2) U28.8(EN)
NetR117_1: R117.1 U28.6(SCL2) ; port EXT_SCL
NetR118_1: R118.1 U28.5(SDA2) ; port EXT_SDA

Not connected (* = marked no-connect by the designer): U20 AA18(IO_L17P_T2_A14_D30_14) AB18(IO_L17N_T2_A13_D29_14) B13(IO_L8N_T1_16) B15(IO_L7P_T1_16) B16(IO_L7N_T1_16) B17(IO_L11P_T1_SRCC_16) B18(IO_L11N_T1_SRCC_16) B20(IO_L16P_T2_16) C13(IO_L8P_T1_16) C14(IO_L3P_T0_DQS_16) C15(IO_L3N_T0_DQS_16) C17(IO_L12N_T1_MRCC_16) C18(IO_L13P_T2_MRCC_16) C19(IO_L13N_T2_MRCC_16) C20(IO_L19N_T3_VREF_16) D14(IO_L6P_T0_16) D15(IO_L6N_T0_VREF_16) D16(IO_L5N_T0_16) D17(IO_L12P_T1_MRCC_16) D19(IO_L14N_T2_SRCC_16) D20(IO_L19P_T3_16) D21(IO_L23N_T3_16) E13(IO_L4P_T0_16) E14(IO_L4N_T0_16) E16(IO_L5P_T0_16) E17(IO_L2N_T0_16) E18(IO_L15N_T2_DQS_16) E19(IO_L14P_T2_SRCC_16) E21(IO_L23P_T3_16) F13(IO_L1P_T0_16) F14(IO_L1N_T0_16) F15(IO_0_16) F16(IO_L2P_T0_16) F18(IO_L15P_T2_DQS_16) F19(IO_L18P_T2_16) F20(IO_L18N_T2_16) F21(IO_25_16) G13(IO_L1N_T0_AD0N_15) G15(IO_L2P_T0_AD8P_15) G21(IO_L24P_T3_16) G22(IO_L24N_T3_16) H13(IO_L1P_T0_AD0P_15) H18(IO_L6N_T0_VREF_15) J16(IO_0_15) K16(IO_L23N_T3_FWE_B_15) L13(IO_L20N_T3_A19_15) L15(IO_L22N_T3_A16_15) L19(IO_L14P_T2_SRCC_15) M13(IO_L20P_T3_A20_15) M17(IO_25_15) M20(IO_L18N_T2_A23_15) P14(IO_L19P_T3_A10_D26_14) P16(IO_L24P_T3_A01_D17_14) P19(IO_L5P_T0_D06_14) R14(IO_L19N_T3_A09_D25_VREF_14) R16(IO_L22N_T3_A04_D20_14) R17(IO_L24N_T3_A00_D16_14) R18(IO_L20P_T3_A08_D24_14) R19(IO_L5N_T0_D07_14) T18(IO_L20N_T3_A07_D23_14) T21(IO_L4P_T0_D04_14) U17(IO_L18P_T2_A12_D28_14) U18(IO_L18N_T2_A11_D27_14) U20(IO_L11P_T1_SRCC_14) V17(IO_L16P_T2_CSI_B_14) V18(IO_L14P_T2_SRCC_14) V19(IO_L14N_T2_SRCC_14) V20(IO_L11N_T1_SRCC_14) W17(IO_L16N_T2_A15_D31_14) W19(IO_L12P_T1_MRCC_14) Y18(IO_L13P_T2_MRCC_14); U29 3(NC) 5(NC) 6(NC)

### Buses and harness runs
bus xADC0_D[15..0] = port ADC0_D[15..0]
bus xADC1_D[15..0] = port ADC1_D[15..0]
bus xUSB_DATA[7..0] = port USB_DATA[7..0]

### Layout directives
net class PLIS_OTHER2: (no net found under the mark)

### Notes on the sheet
- Какой уровень интерфейсов
- PIO 2.5V
- PIO 1.5V
- PIO 3.3V
- PIO ??
- Лист
- /
- Изм.
- № докум.
- Подп.
- Дата.
- (in symbol ADN4661) LVDS; Vcc; Dout+; +; Din; -; Dout-
- (in symbol XC7A200T-2FBG484I, part A) BANK 13
- (in symbol XC7A200T-2FBG484I, part B) BANK 14
- (in symbol XC7A200T-2FBG484I, part C) BANK 15
- (in symbol XC7A200T-2FBG484I, part D) BANK 16

### Library data of the parts
C102-C104 = Cap: Конденсатор керамический; Voltage: 10V; PackageReference: 0402; ClassName: Xilinx PWR
C105 = Cap: GRM21BR61E106KA73L; PackageReference: 0805; ClassName: Power1.5
JP1 = SIP3: Печатная перемычка на плате
R99-R118 = Res2: Резистор; PackageReference: 0402; ClassName: LEVEL SHIFTER
U20 = XC7A200T-2FBG484I: Artix-7 FPGA, 285 User I/Os, 4 GTP, 484-Ball BGA; Manufacturer: Xilinx; CLBs (Slices): 33650; DSP48E1 Slices: 740; Block RAM Blocks (36Kb): 365; Logic Cells: 215360; Block RAM Blocks (Max Kb): 13140; Speed Grade: -2; Clock Mgmt Tiles (CMTs): 10; Block RAM Blocks (18Kb): 730; Max User I/O: 500; ComponentLink5Description: Packaging and Pinout; CLBs (Max Distributed RAM Kb): 2888; ComponentLink4Description: Package File; ComponentLink5URL: http://www.xilinx.com/support/documentation/user_guides/ug475_7Series_Pkg_Pinout.pdf; ComponentLink1Description: Datasheet; ComponentLink2Description: Package Specification; DatasheetVersion: v1.12; ComponentLink3URL: http://www.xilinx.com/support/documentation/data_sheets/ds181_Artix_7_Data_Sheet.pdf; ComponentLink1URL: http://www.xilinx.com/support/documentation/data_sheets/ds180_7Series_Overview.pdf; Code_JEDEC: MS-034; ComponentLink2URL: http://www.xilinx.com/support/documentation/user_guides/ug475_7Series_Pkg_Pinout.pdf; ComponentLink3Description: DC and Switching Characteristics; Generic Part Number: XC7A200T; RoHS: Pb-Free; ComponentLink4URL: http://www.xilinx.com/support/packagefiles/a7packages/xc7a200tfbg484pkg.txt; PackageVersion: Rev 1.8; PackageReference: FBG484; PackageDescription: Flip-Chip Lidless BGA, Body 23 x 23 mm, 1.0 mm Pitch; Value: XC7A200T-2FBG484I
U21-U24 = SN74LXC2T45: Преобразователь уровня; PackageReference: VSSOP; Value: SN74LXC2T45
U25-U28 = PCA9306: Преобразователь уровня I2C; PackageReference: QFN-10; Value: PCA9306; ClassName: LEVEL SHIFTER
U29 = ADN4661: LVDS, High Speed Differential Driver; Value: DS90LV047A; PackageReference: SO8; ClassName: LEVEL SHIFTER

## Sheet USB_CAN.SchDoc
size A3; Author: Швецов С.В.; Organization: PapuaSoft; SheetNumber: 3; SheetTotal: 8
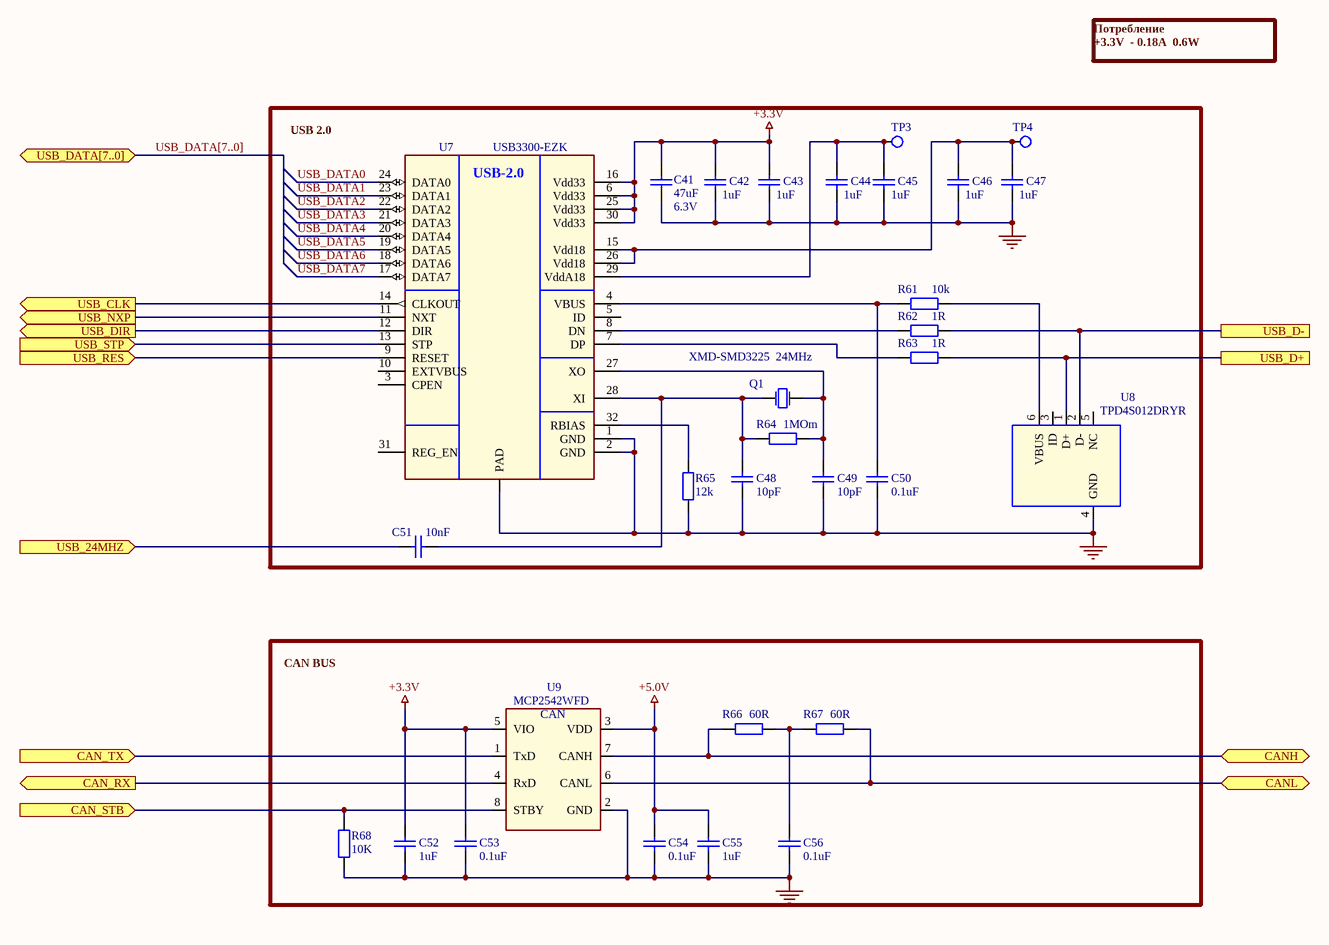
[diagram p2: USB_CAN.SchDoc]

### Parts
C41  value 47uF  Voltage: 6.3V  [C0805]  (hidden comment: Cap)
C42  value 1uF  [C0603]  (hidden comment: Cap)
C43  value 1uF  [C0603]  (hidden comment: Cap)
C44  value 1uF  [C0603]  (hidden comment: Cap)
C45  value 1uF  [C0603]  (hidden comment: Cap)
C46  value 1uF  [C0603]  (hidden comment: Cap)
C47  value 1uF  [C0603]  (hidden comment: Cap)
C48  value 10pF  [C0402]  (hidden comment: Cap)
C49  value 10pF  [C0402]  (hidden comment: Cap)
C50  value 0.1uF  [C0402]  (hidden comment: Cap)
C51  value 10nF  [C0402]  (hidden comment: Cap)
C52  value 1uF  [C0603]  (hidden comment: Cap)
C53  value 0.1uF  [C0402]  (hidden comment: Cap)
C54  value 0.1uF  [C0402]  (hidden comment: Cap)
C55  value 1uF  [C0603]  (hidden comment: Cap)
C56  value 0.1uF  [C0402]  (hidden comment: Cap)
Q1  XMD-SMD3225  24MHz  [KX-5T]
R61  value 10k  [R0402]  (hidden comment: Res2)
R62  value 1R  [R0402]  (hidden comment: Res2)
R63  value 1R  [R0402]  (hidden comment: Res2)
R64  value 1MOm  [R0402]  (hidden comment: Res2)
R65  value 12k  [R0402]  (hidden comment: Res2)
R66  value 60R  [R0402]  (hidden comment: Res2)
R67  value 60R  [R0402]  (hidden comment: Res2)
R68  value 10K  [R0402]  (hidden comment: Res2)
TP3  (no value)  [TP_0MM5_1MM0]  (no BOM)
TP4  (no value)  [TP_0MM5_1MM0]  (no BOM)
U7  USB3300-EZK  [QFN-32]
U8  value TPD4S012DRYR  [TPD4S012DRYR]
U9  MCP2542WFD  [SO8]

### Ports
CAN_RX (out), CAN_STB (in), CAN_TX (in), CANH (bidir), CANL (bidir), USB_24MHZ (in), USB_CLK (out), USB_D+, USB_D-, USB_DATA[7..0] (bidir), USB_DIR (out), USB_NXP (out), USB_RES (in), USB_STP (in)

### Nets
+3.3V: C41.1 C42.2 C43.2 C52.1 C53.1 U7.6(Vdd33) U7.16(Vdd33) U7.25(Vdd33) U7.30(Vdd33) U9.5(NC)
+5.0V: C54.1 C55.1 U9.3(VDD)
GND: C41.2 C42.1 C43.1 C44.1 C45.1 C46.1 C47.1 C48.2 C49.2 C50.2 C52.2 C53.2 C54.2 C55.2 C56.2 R65.2 R68.2 U7.0(PAD) U7.1(GND) U7.2(GND) U8.4(GND) U9.2(GND)  [project net +12V_INPUT]
USB_DATA0: U7.24(DATA0)
USB_DATA1: U7.23(DATA1)
USB_DATA2: U7.22(DATA2)
USB_DATA3: U7.21(DATA3)
USB_DATA4: U7.20(DATA4)
USB_DATA5: U7.19(DATA5)
USB_DATA6: U7.18(DATA6)
USB_DATA7: U7.17(DATA7)
xCAN_RX: U9.4(NC) ; port CAN_RX
xCAN_STB: R68.1 U9.8(STBY) ; port CAN_STB
xCAN_TX: U9.1(TxD) ; port CAN_TX
xUSB_24MHZ: C51.1 ; port USB_24MHZ
xUSB_DIR: U7.12(DIR) ; port USB_DIR
xUSB_NXP: U7.11(NXT) ; port USB_NXP
xUSB_RES: U7.9(RESET) ; port USB_RES
xUSB_SCK: U7.14(CLKOUT) ; port USB_CLK
xUSB_STP: U7.13(STP) ; port USB_STP
NetC44_2: C44.2 C45.2 TP3.1(e1) U7.29(VddA18)
NetC46_2: C46.2 C47.2 TP4.1(e1) U7.15(Vdd18) U7.26(Vdd18)
NetC48_1: C48.1 C51.2 Q1.1(OSC1) R64.1 U7.28(XI)
NetC49_1: C49.1 Q1.3(OSC2) R64.2 U7.27(XO)
NetC50_1: C50.1 R61.1 U7.4(VBUS)
NetC56_1: C56.1 R66.1 R67.2
NetR61_2: R61.2 U8.6(VBUS)
NetR62_1: R62.1 U8.2(D-) ; port USB_D-
NetR62_2: R62.2 U7.8(DN)
NetR63_1: R63.1 U8.1(D+) ; port USB_D+
NetR63_2: R63.2 U7.7(DP)
NetR65_1: R65.1 U7.32(RBIAS)
NetR66_2: R66.2 U9.7(CANH) ; port CANH
NetR67_1: R67.1 U9.6(CANL) ; port CANL

Not connected (* = marked no-connect by the designer): U7 3(CPEN) 5(ID) 10(EXTVBUS) 31(REG_EN); U8 3(ID) 5(NC)

### Buses and harness runs
bus USB_DATA[7..0] = port USB_DATA[7..0]

### Notes on the sheet
- Потребление
  +3.3V  - 0.18A  0.6W
- (near U7) USB 2.0
- CAN BUS
- Лист
- /
- Изм.
- № докум.
- Подп.
- Дата.
- (in symbol L7805) CAN
- (in symbol USB3300) USB-2.0

### Library data of the parts
C41 = Cap: C0805C476M9PAC; PackageReference: 0805; ClassName: Xilinx PWR
C42-C47 C52 C55 = Cap: Конденсатор керамический; PackageReference: 0603
  C42-C47: ClassName: USB-2.0
  C52 C55: ClassName: CAN BUS
C48 C49 = Cap: GRM1535C1H100J; PackageReference: 0402; ClassName: USB-2.0
C50 C51 C53 C54 C56 = Cap: Конденсатор керамический; Voltage: 25V; PackageReference: 0402
  C50 C51: ClassName: USB-2.0
  C53 C54 C56: ClassName: CAN BUS
Q1 = XTAL: Chengdu Kingbri Frequency Technology Co., Ltd   24MHz; Value: 01XMD118JVF0024000000; PackageReference: SMD 3.2x2.5мм; ClassName: USB-2.0
R61-R64 R66-R68 = Res2: Резистор; PackageReference: 0402
  R61-R64: ClassName: USB-2.0
  R66-R68: ClassName: CAN BUS
R65 = Res2: Резистор; Precision: 1%; PackageReference: 0402; ClassName: USB-2.0
TP3 TP4 = Test_Point: Тестовая точка на плате; MarkPCB: +5V; ClassName: USB-2.0
U7 = USB3300: USB-2.0 driver; Value: USB3300-EZK; PackageReference: QFN32
U8 = TPD4S012DRYR: Защитные диоды USB; PackageReference: SON6; ClassName: USB-2.0
U9 = L7805: CAN Transceiver; PackageReference: SO8; Value: MCP2542WFD; ClassName: CAN BUS

## Sheet BiSS.SchDoc
size A3; Author: Швецов С.В.; Organization: PapuaSoft; SheetNumber: 4; SheetTotal: 8; PageSetup: Record=PageOptions|CenterHorizontal=True|CenterVertical=True|PrintScale=0.71|XCorrection=1.00|YCorrection=1.00|PrintKind=1|BorderSize=5000000|LeftOffset=0|BottomOffset=0|Orientation=2|PaperLength=1000|PaperWidth=1000|Scale=100|PaperSource=15|PrintQuality=600|MediaType=1|DitherType=10|PaperKind=A4|PrintScaleMode=1
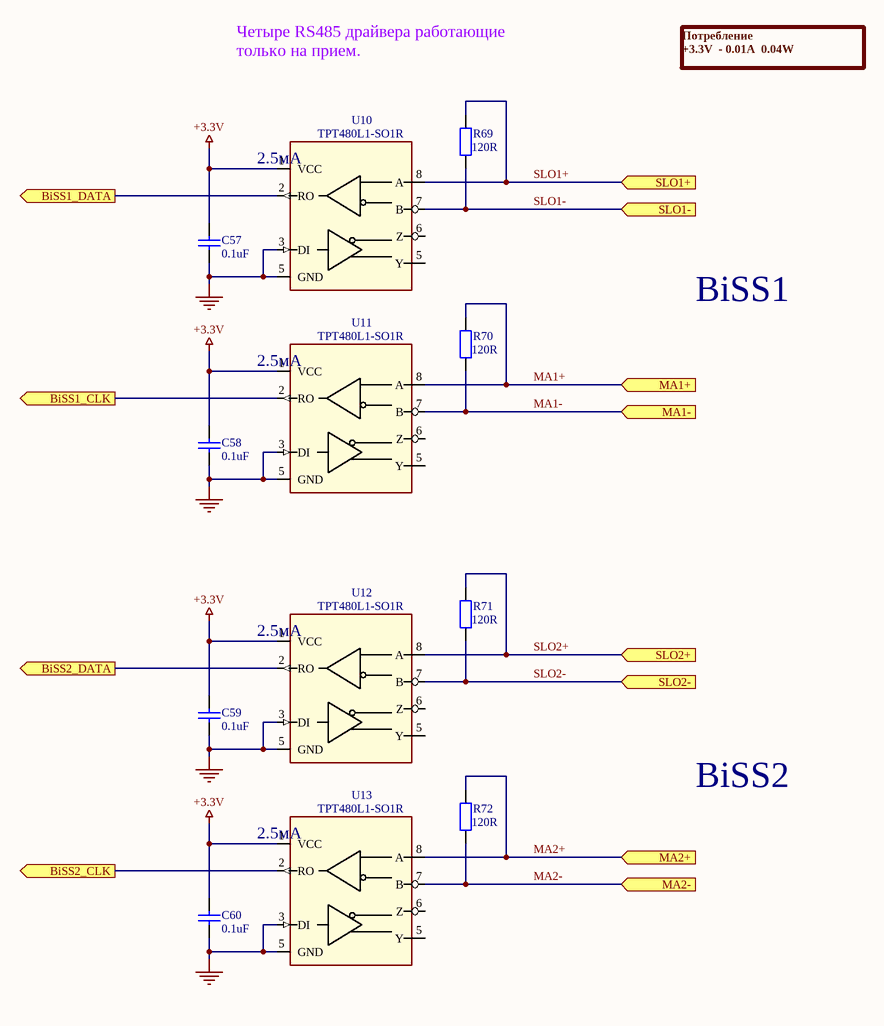
[diagram p3: BiSS.SchDoc]

### Parts
C57  value 0.1uF  [C0402]  (hidden comment: Cap)
C58  value 0.1uF  [C0402]  (hidden comment: Cap)
C59  value 0.1uF  [C0402]  (hidden comment: Cap)
C60  value 0.1uF  [C0402]  (hidden comment: Cap)
R69  value 120R  [R0402]  (hidden comment: Res2)
R70  value 120R  [R0402]  (hidden comment: Res2)
R71  value 120R  [R0402]  (hidden comment: Res2)
R72  value 120R  [R0402]  (hidden comment: Res2)
U10  TPT480L1-SO1R  [SO8]
U11  TPT480L1-SO1R  [SO8]
U12  TPT480L1-SO1R  [SO8]
U13  TPT480L1-SO1R  [SO8]

### Ports
BiSS1_CLK (out), BiSS1_DATA (out), BiSS2_CLK (out), BiSS2_DATA (out), MA1+ (in), MA1- (in), MA2+ (in), MA2- (in), SLO1+ (in), SLO1- (in), SLO2+ (in), SLO2- (in)

### Nets
+3.3V: C57.1 C58.1 C59.1 C60.1 U10.1(VCC) U11.1(VCC) U12.1(VCC) U13.1(VCC)
GND: C57.2 C58.2 C59.2 C60.2 U10.3(DI) U10.5(GND) U11.3(DI) U11.5(GND) U12.3(DI) U12.5(GND) U13.3(DI) U13.5(GND)  [project net +12V_INPUT]
MA1+: R70.1 U11.8(A) ; port MA1+
MA1-: R70.2 U11.7(B) ; port MA1-
MA2+: R72.1 U13.8(A) ; port MA2+
MA2-: R72.2 U13.7(B) ; port MA2-
SLO1+: R69.1 U10.8(A) ; port SLO1+
SLO1-: R69.2 U10.7(B) ; port SLO1-
SLO2+: R71.1 U12.8(A) ; port SLO2+
SLO2-: R71.2 U12.7(B) ; port SLO2-
xBiSS1_CLK: U11.2(RO) ; port BiSS1_CLK
xBiSS1_DATA: U10.2(RO) ; port BiSS1_DATA
xBiSS2_CLK: U13.2(RO) ; port BiSS2_CLK
xBiSS2_DATA: U12.2(RO) ; port BiSS2_DATA

Not connected (* = marked no-connect by the designer): U10 6(Z); U11 6(Z); U12 6(Z); U13 6(Z)

### Notes on the sheet
- Потребление
  +3.3V  - 0.01A  0.04W
- (near R69) Четыре RS485 драйвера работающие только на прием.
- (near U10) 2.5мА
- BiSS1
- (near U11) 2.5мА
- (near U12) 2.5мА
- BiSS2
- (near U13) 2.5мА
- Лист
- /
- Изм.
- № докум.
- Подп.
- Дата.

### Library data of the parts
C57-C60 = Cap: Конденсатор керамический; Voltage: 25V; PackageReference: 0402; ClassName: BiSS
R69-R72 = Res2: Резистор; PackageReference: 0402; ClassName: BiSS
U10-U13 = MAX3078E: RS-485 Transievers; PackageReference: SO8; Value: TPT480L1-SO1R; ClassName: BiSS

## Sheet UART_USB.SchDoc
size A3; Author: Швецов С.В.; Organization: PapuaSoft; SheetNumber: 8; SheetTotal: 8
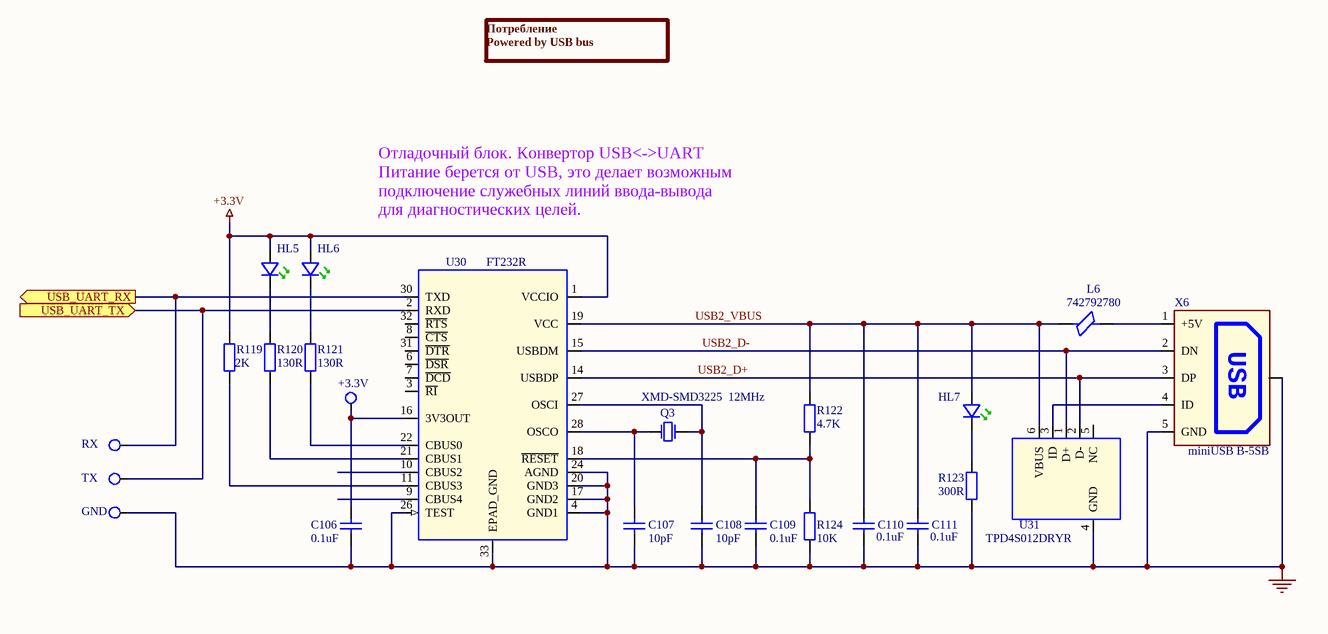
[diagram p4: UART_USB.SchDoc]

### Parts
C106  value 0.1uF  [C0402]  (hidden comment: Cap)
C107  value 10pF  [C0402]  (hidden comment: Cap)
C108  value 10pF  [C0402]  (hidden comment: Cap)
C109  value 0.1uF  [C0402]  (hidden comment: Cap)
C110  value 0.1uF  [C0402]  (hidden comment: Cap)
C111  value 0.1uF  [C0402]  (hidden comment: Cap)
HL5  (no value)  [KP-1608_16x08x11_L]
HL6  (no value)  [KP-1608_16x08x11_L]
HL7  (no value)  [KP-1608_16x08x11_L]
L6  742792780  [L0402]
Q3  XMD-SMD3225  12MHz  [KX-5T]
R119  value 2K  [R0402]  (hidden comment: Res2)
R120  value 130R  [R0402]  (hidden comment: Res2)
R121  value 130R  [R0402]  (hidden comment: Res2)
R122  value 4.7K  [R0402]  (hidden comment: Res2)
R123  value 300R  [R0402]  (hidden comment: Res2)
R124  value 10K  [R0402]  (hidden comment: Res2)
TP21  MarkPCB: +3.3V  [TP_0MM5_1MM0]  (no BOM)
TP22  MarkPCB: RX  [TP_0MM5_1MM0]  (no BOM)
TP23  MarkPCB: TX  [TP_0MM5_1MM0]  (no BOM)
TP24  MarkPCB: GND  [TP_0MM5_1MM0]  (no BOM)
U30  FT232R  [QFN32_FT232RQ_FTD-L]
U31  value TPD4S012DRYR  [TPD4S012DRYR]
X6  value miniUSB B-5SB  [USBSMALL]  (hidden comment: USB)

### Ports
USB_UART_RX (out), USB_UART_TX (in)

### Nets
+3.3V: HL5.1(Anode) HL6.1(Anode) R119.2 U30.1(VCCIO)
GND: C106.2 C107.2 C108.2 C109.2 C110.2 C111.2 R123.2 R124.2 TP24.1(e1) U30.4(GND1) U30.17(GND2) U30.20(GND3) U30.24(AGND) U30.26(TEST) U30.33(EPAD_GND) U31.4(GND) X6.0(PAD) X6.5(GND)  [project net +12V_INPUT]
USB2_D+: U30.14(USBDP) U31.2(D-) X6.3(DP)
USB2_D-: U30.15(USBDM) U31.1(D+) X6.2(DN)
USB2_VBUS: C110.1 C111.1 HL7.1(Anode) L6.1 R122.1 U30.19(VCC) U31.6(VBUS)
xUSB_UART_RX: TP22.1(e1) U30.30(TXD) ; port USB_UART_RX
xUSB_UART_TX: TP23.1(e1) U30.2(RXD) ; port USB_UART_TX
NetC106_1: C106.1 TP21.1(e1) U30.16(3V3OUT)
NetC107_1: C107.1 Q3.3(OSC2) U30.28(OSCO)
NetC108_1: C108.1 Q3.1(OSC1) U30.27(OSCI)
NetC109_1: C109.1 R122.2 R124.1 U30.18(~{RESET})
NetHL5_2: HL5.2(Cathode) R120.2
NetHL6_2: HL6.2(Cathode) R121.2
NetHL7_2: HL7.2(Cathode) R123.1
NetL6_2: L6.2 X6.1(+5V)
NetR119_1: R119.1 U30.11(CBUS3)
NetR120_1: R120.1 U30.21(CBUS1)
NetR121_1: R121.1 U30.22(CBUS0)
NetU31_3: U31.3(ID) X6.4(ID)

Not connected (* = marked no-connect by the designer): U30 3(~{RI}) 6(~{DSR}) 7(~{DCD}) 8(~{CTS}) 9(CBUS4) 10(CBUS2) 31(~{DTR}) 32(~{RTS}); U31 5(NC)

### Notes on the sheet
- Потребление
  Powered by USB bus
- Отладочный блок. Конвертор USB<->UART
  Питание берется от USB, это делает возможным подключение служебных линий ввода-вывода для диагностических целей.
- Лист
- /
- Изм.
- № докум.
- Подп.
- Дата.

### Library data of the parts
C106 C109-C111 = Cap: Конденсатор керамический; Voltage: 25V; PackageReference: 0402; ClassName: UART_USB
  C109-C111: Parameter 1: *
C107 C108 = Cap: GRM1535C1H100J; PackageReference: 0402; ClassName: UART_USB
HL5-HL7 = ledG_KP-1608MGC_KP-1608: 1.6X0.8mm SMD  LED; LxWxH(mm): 1,6x0,8x1,1; Value: KP-1608MGC; PackageReference: 0603; Package: KP-1608_16x08x11; ClassName: UART_USB
  HL7: Parameter 1: *
L6 = BEAD_FERRITE_SM: Wurth Elektronik EMI FILTERS FERRITE BEAD, 220R@100MHz, 0.35R; PackageReference: 0402; Value: 742792780; ClassName: UART_USB
Q3 = XTAL: Chengdu Kingbri Frequency Technology Co., Ltd  12MHz; Value: 01XMD118JVF0012000000; PackageReference: SMD 3.2x2.5мм; ClassName: UART_USB
R119-R124 = Res2: Резистор; PackageReference: 0402; ClassName: UART_USB
  R122-R124: Parameter 1: *
TP21-TP24 = Test_Point: Тестовая точка на плате; ClassName: UART_USB
U30 = FT232R_2: USB to serial UART interface; Part Class: ICS; Item Num: P01-17819R; Value: FT232RQ-REEL; Device: U17; Num Pins: 32; PackageReference: QFN32; ClassName: UART_USB
U31 = TPD4S012DRYR: Защитные диоды USB; PackageReference: SON6; ClassName: UART_USB; Parameter 1: *
X6 = USB: 5-контактная SMD розетка; ClassName: UART_USB; Parameter 1: *